# Altium schematic sheet Cell_Balancing.SchDoc
size A4; Organization: TESLA Motors, INC; Address1: 3500 Deer Creek Road; Address2: Palo Alto, CA; Address4: U.S.A.; SheetNumber: 4; SheetTotal: 11
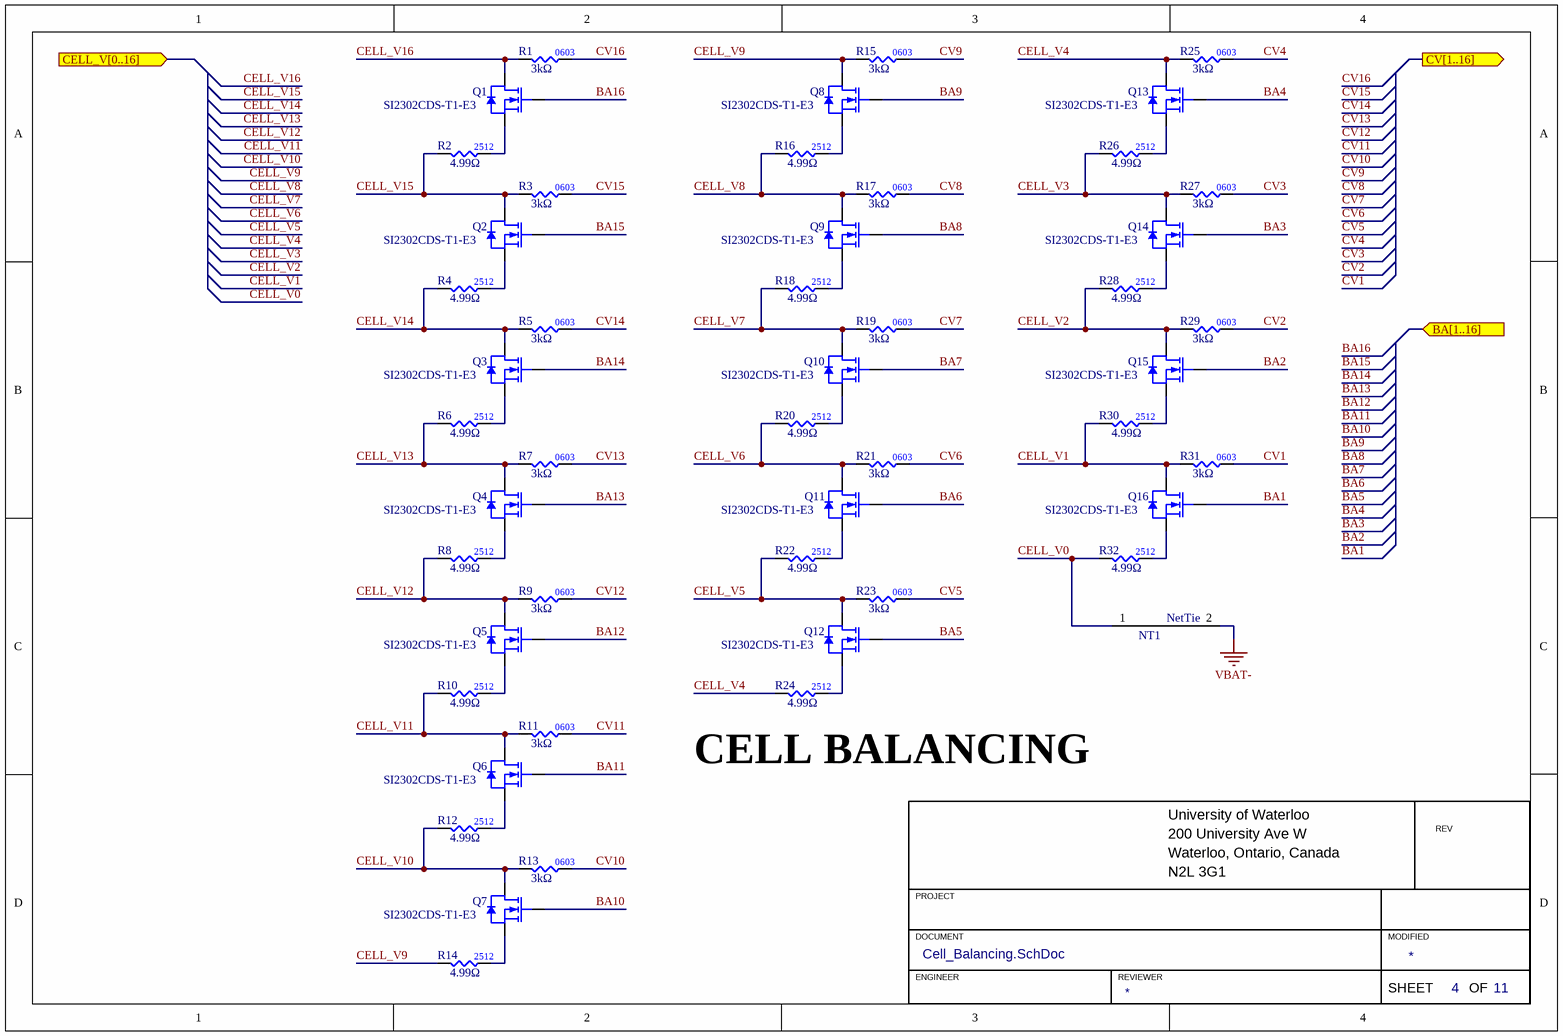
[diagram p0: Cell_Balancing.SchDoc]

## Parts
NT1  NetTie  [NET_TIE]  (value not drawn)
Q1  Manufacturer Part Number 1: SI2302CDS-T1-E3  [SOT23-3]  (hidden comment: NMOS_20V_6A)
Q2  Manufacturer Part Number 1: SI2302CDS-T1-E3  [SOT23-3]  (hidden comment: NMOS_20V_6A)
Q3  Manufacturer Part Number 1: SI2302CDS-T1-E3  [SOT23-3]  (hidden comment: NMOS_20V_6A)
Q4  Manufacturer Part Number 1: SI2302CDS-T1-E3  [SOT23-3]  (hidden comment: NMOS_20V_6A)
Q5  Manufacturer Part Number 1: SI2302CDS-T1-E3  [SOT23-3]  (hidden comment: NMOS_20V_6A)
Q6  Manufacturer Part Number 1: SI2302CDS-T1-E3  [SOT23-3]  (hidden comment: NMOS_20V_6A)
Q7  Manufacturer Part Number 1: SI2302CDS-T1-E3  [SOT23-3]  (hidden comment: NMOS_20V_6A)
Q8  Manufacturer Part Number 1: SI2302CDS-T1-E3  [SOT23-3]  (hidden comment: NMOS_20V_6A)
Q9  Manufacturer Part Number 1: SI2302CDS-T1-E3  [SOT23-3]  (hidden comment: NMOS_20V_6A)
Q10  Manufacturer Part Number 1: SI2302CDS-T1-E3  [SOT23-3]  (hidden comment: NMOS_20V_6A)
Q11  Manufacturer Part Number 1: SI2302CDS-T1-E3  [SOT23-3]  (hidden comment: NMOS_20V_6A)
Q12  Manufacturer Part Number 1: SI2302CDS-T1-E3  [SOT23-3]  (hidden comment: NMOS_20V_6A)
Q13  Manufacturer Part Number 1: SI2302CDS-T1-E3  [SOT23-3]  (hidden comment: NMOS_20V_6A)
Q14  Manufacturer Part Number 1: SI2302CDS-T1-E3  [SOT23-3]  (hidden comment: NMOS_20V_6A)
Q15  Manufacturer Part Number 1: SI2302CDS-T1-E3  [SOT23-3]  (hidden comment: NMOS_20V_6A)
Q16  Manufacturer Part Number 1: SI2302CDS-T1-E3  [SOT23-3]  (hidden comment: NMOS_20V_6A)
R1  value 3kΩ  [RES0603]  (hidden comment: RES_3kΩ_0603_1%)
R2  value 4.99Ω  [RES2512]  (hidden comment: RES_4.99Ω_2512_1%)
R3  value 3kΩ  [RES0603]  (hidden comment: RES_3kΩ_0603_1%)
R4  value 4.99Ω  [RES2512]  (hidden comment: RES_4.99Ω_2512_1%)
R5  value 3kΩ  [RES0603]  (hidden comment: RES_3kΩ_0603_1%)
R6  value 4.99Ω  [RES2512]  (hidden comment: RES_4.99Ω_2512_1%)
R7  value 3kΩ  [RES0603]  (hidden comment: RES_3kΩ_0603_1%)
R8  value 4.99Ω  [RES2512]  (hidden comment: RES_4.99Ω_2512_1%)
R9  value 3kΩ  [RES0603]  (hidden comment: RES_3kΩ_0603_1%)
R10  value 4.99Ω  [RES2512]  (hidden comment: RES_4.99Ω_2512_1%)
R11  value 3kΩ  [RES0603]  (hidden comment: RES_3kΩ_0603_1%)
R12  value 4.99Ω  [RES2512]  (hidden comment: RES_4.99Ω_2512_1%)
R13  value 3kΩ  [RES0603]  (hidden comment: RES_3kΩ_0603_1%)
R14  value 4.99Ω  [RES2512]  (hidden comment: RES_4.99Ω_2512_1%)
R15  value 3kΩ  [RES0603]  (hidden comment: RES_3kΩ_0603_1%)
R16  value 4.99Ω  [RES2512]  (hidden comment: RES_4.99Ω_2512_1%)
R17  value 3kΩ  [RES0603]  (hidden comment: RES_3kΩ_0603_1%)
R18  value 4.99Ω  [RES2512]  (hidden comment: RES_4.99Ω_2512_1%)
R19  value 3kΩ  [RES0603]  (hidden comment: RES_3kΩ_0603_1%)
R20  value 4.99Ω  [RES2512]  (hidden comment: RES_4.99Ω_2512_1%)
R21  value 3kΩ  [RES0603]  (hidden comment: RES_3kΩ_0603_1%)
R22  value 4.99Ω  [RES2512]  (hidden comment: RES_4.99Ω_2512_1%)
R23  value 3kΩ  [RES0603]  (hidden comment: RES_3kΩ_0603_1%)
R24  value 4.99Ω  [RES2512]  (hidden comment: RES_4.99Ω_2512_1%)
R25  value 3kΩ  [RES0603]  (hidden comment: RES_3kΩ_0603_1%)
R26  value 4.99Ω  [RES2512]  (hidden comment: RES_4.99Ω_2512_1%)
R27  value 3kΩ  [RES0603]  (hidden comment: RES_3kΩ_0603_1%)
R28  value 4.99Ω  [RES2512]  (hidden comment: RES_4.99Ω_2512_1%)
R29  value 3kΩ  [RES0603]  (hidden comment: RES_3kΩ_0603_1%)
R30  value 4.99Ω  [RES2512]  (hidden comment: RES_4.99Ω_2512_1%)
R31  value 3kΩ  [RES0603]  (hidden comment: RES_3kΩ_0603_1%)
R32  value 4.99Ω  [RES2512]  (hidden comment: RES_4.99Ω_2512_1%)

## Ports
BA[1..16] (in), CELL_V[0..16] (in), CV[1..16] (out)

## Nets
VBAT-: NT1.2
BA1: Q16.1(GATE)
BA2: Q15.1(GATE)
BA3: Q14.1(GATE)
BA4: Q13.1(GATE)
BA5: Q12.1(GATE)
BA6: Q11.1(GATE)
BA7: Q10.1(GATE)
BA8: Q9.1(GATE)
BA9: Q8.1(GATE)
BA10: Q7.1(GATE)
BA11: Q6.1(GATE)
BA12: Q5.1(GATE)
BA13: Q4.1(GATE)
BA14: Q3.1(GATE)
BA15: Q2.1(GATE)
BA16: Q1.1(GATE)
CELL_V0: NT1.1 R32.1
CELL_V1: Q16.3(DRAIN) R30.1 R31.1
CELL_V2: Q15.3(DRAIN) R28.1 R29.1
CELL_V3: Q14.3(DRAIN) R26.1 R27.1
CELL_V4: Q13.3(DRAIN) R24.1 R25.1
CELL_V5: Q12.3(DRAIN) R22.1 R23.1
CELL_V6: Q11.3(DRAIN) R20.1 R21.1
CELL_V7: Q10.3(DRAIN) R18.1 R19.1
CELL_V8: Q9.3(DRAIN) R16.1 R17.1
CELL_V9: Q8.3(DRAIN) R14.1 R15.1
CELL_V10: Q7.3(DRAIN) R12.1 R13.1
CELL_V11: Q6.3(DRAIN) R10.1 R11.1
CELL_V12: Q5.3(DRAIN) R8.1 R9.1
CELL_V13: Q4.3(DRAIN) R6.1 R7.1
CELL_V14: Q3.3(DRAIN) R4.1 R5.1
CELL_V15: Q2.3(DRAIN) R2.1 R3.1
CELL_V16: Q1.3(DRAIN) R1.1
CV1: R31.2
CV2: R29.2
CV3: R27.2
CV4: R25.2
CV5: R23.2
CV6: R21.2
CV7: R19.2
CV8: R17.2
CV9: R15.2
CV10: R13.2
CV11: R11.2
CV12: R9.2
CV13: R7.2
CV14: R5.2
CV15: R3.2
CV16: R1.2
NetQ1_2: Q1.2(SOURCE) R2.2
NetQ2_2: Q2.2(SOURCE) R4.2
NetQ3_2: Q3.2(SOURCE) R6.2
NetQ4_2: Q4.2(SOURCE) R8.2
NetQ5_2: Q5.2(SOURCE) R10.2
NetQ6_2: Q6.2(SOURCE) R12.2
NetQ7_2: Q7.2(SOURCE) R14.2
NetQ8_2: Q8.2(SOURCE) R16.2
NetQ9_2: Q9.2(SOURCE) R18.2
NetQ10_2: Q10.2(SOURCE) R20.2
NetQ11_2: Q11.2(SOURCE) R22.2
NetQ12_2: Q12.2(SOURCE) R24.2
NetQ13_2: Q13.2(SOURCE) R26.2
NetQ14_2: Q14.2(SOURCE) R28.2
NetQ15_2: Q15.2(SOURCE) R30.2
NetQ16_2: Q16.2(SOURCE) R32.2

## Notes on the sheet
- (near R24) CELL BALANCING
- University of Waterloo
- 200 University Ave W
- REV
- PROJECT
- Waterloo, Ontario, Canada
- N2L 3G1
- DOCUMENT
- ENGINEER
- REVIEWER
- MODIFIED
- SHEET
- OF
- (in symbol RES_3kΩ_0603_1%) 0603
- (in symbol RES_4.99Ω_2512_1%) 2512

## Library data of the parts
Q1-Q16 = NMOS_20V_2.6A: MOSFET N-CH 20V 2.6A SOT23-3; Manufacturer 1: Vishay Siliconix; Package/Footprint: SOT-23-3; Supplier 1: Digi-Key; Supplier Part Number 1: SI2302CDS-T1-E3CT-ND
R1 R3 R5 R7 R9 R11 R13 R15 R17 R19 R21 R23 R25 R27 R29 R31 = RES_3kΩ_0603_1%: RES 3K OHM 1% 1/10W 0603; Manufacturer 1: Yageo; Manufacturer Part Number 1: RC0603FR-073KL; Supplier 1: Digi-Key; Supplier Part Number 1: 311-3.00KHRCT-ND
R2 R4 R6 R8 R10 R12 R14 R16 R18 R20 R22 R24 R26 R28 R30 R32 = RES_4.99Ω_2512_1%: RES 4.99 OHM 1% 2W 2512; Manufacturer 1: Stackpole Electronics Inc; Manufacturer Part Number 1: RHC2512FT4R99; Supplier 1: Digi-Key; Supplier Part Number 1: RHC2512FT4R99CT-ND